# EAGLE design esp8266_3C_noGND (EAGLE 7.5.0)
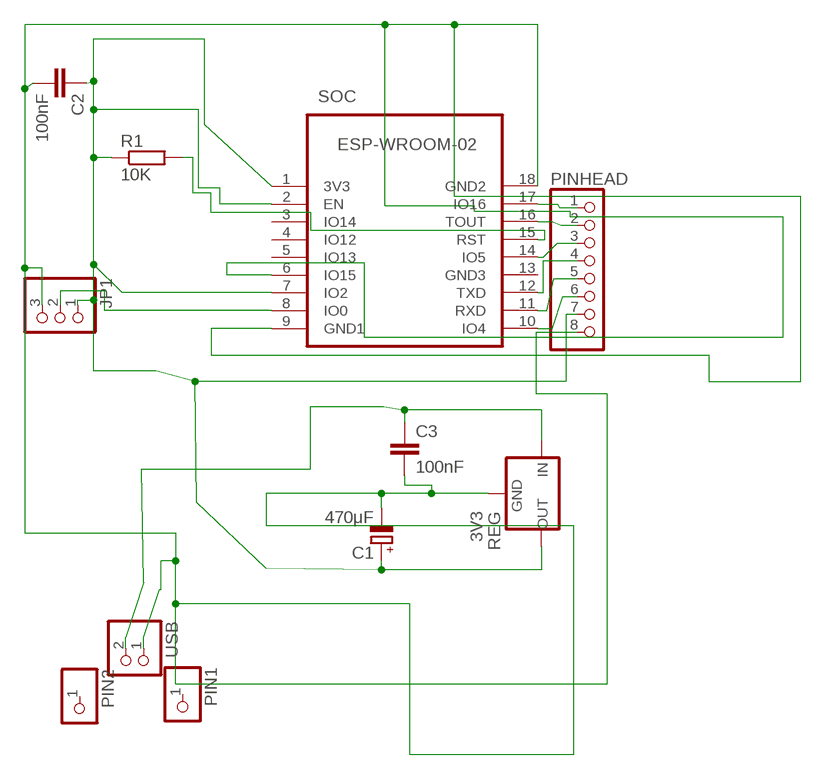
[diagram p0: schematic, sheet 1]

## Parts
C1  470μF  CPOL-EUE2.5-7  [E2,5-7]
C2  100nF  C-EUC0603  [C0603]
C3  100nF  C-EUC0603  [C0603]
JP1  PINHD-1X3  [1X03]
PIN1  PINHD-1X1  [1X01]
PIN2  PINHD-1X1  [1X01]
PINHEAD  PINHD-1X8  [1X08]
R1  10K  R-EU_R0603  [R0603]
REG  3V3  78XXS  [78XXS]
SOC  ESP-WROOM-02  ESP-WROOM-02-CP2FRONT  [FRONT-FACE-CP2]
USB  PINHD-1X2  [1X02]

## Nets
N$1: JP1.2 SOC.8(IO0)
N$2: C3.1 REG.IN USB.2
N$6: PINHEAD.1 SOC.17(IO16)
N$7: PINHEAD.2 SOC.16(TOUT)
N$8: PINHEAD.3 SOC.14(IO5)
N$9: PINHEAD.4 SOC.12(TXD)
N$10: PINHEAD.5 SOC.11(RXD)
N$11: PINHEAD.6 SOC.10(IO4)
N$12: C1.+ C2.1 JP1.1 PINHEAD.7 R1.1 REG.OUT SOC.1(3V3) SOC.2(EN) SOC.7(IO2)
N$13: R1.2 SOC.15(RST)
USB: C1.- C2.2 C3.2 JP1.3 PINHEAD.8 REG.GND SOC.6(IO15) SOC.9(GND1) SOC.18(GND2) USB.1
Unconnected: PIN1.1 PIN2.1 SOC.3(IO14) SOC.4(IO12) SOC.5(IO13) SOC.13(GND3)

## Library data of the parts
C1 = rcl:CPOL-EU: POLARIZED CAPACITOR, European symbol
C2 C3 = resistor:C-EU: CAPACITOR, European symbol
JP1 = pinhead:PINHD-1X3: PIN HEADER
PIN1 PIN2 = pinhead-ext3:PINHD-1X1: PIN HEADER
PINHEAD = pinhead:PINHD-1X8: PIN HEADER
R1 = resistor:R-EU_: RESISTOR, European symbol
REG = v-reg:78XXS: VOLTAGE REGULATOR
SOC = esp-wroom-02-CP2:ESP-WROOM-02-CP2: WiFi module - ESP-WROOM-02
USB = pinhead:PINHD-1X2: PIN HEADER

## Board
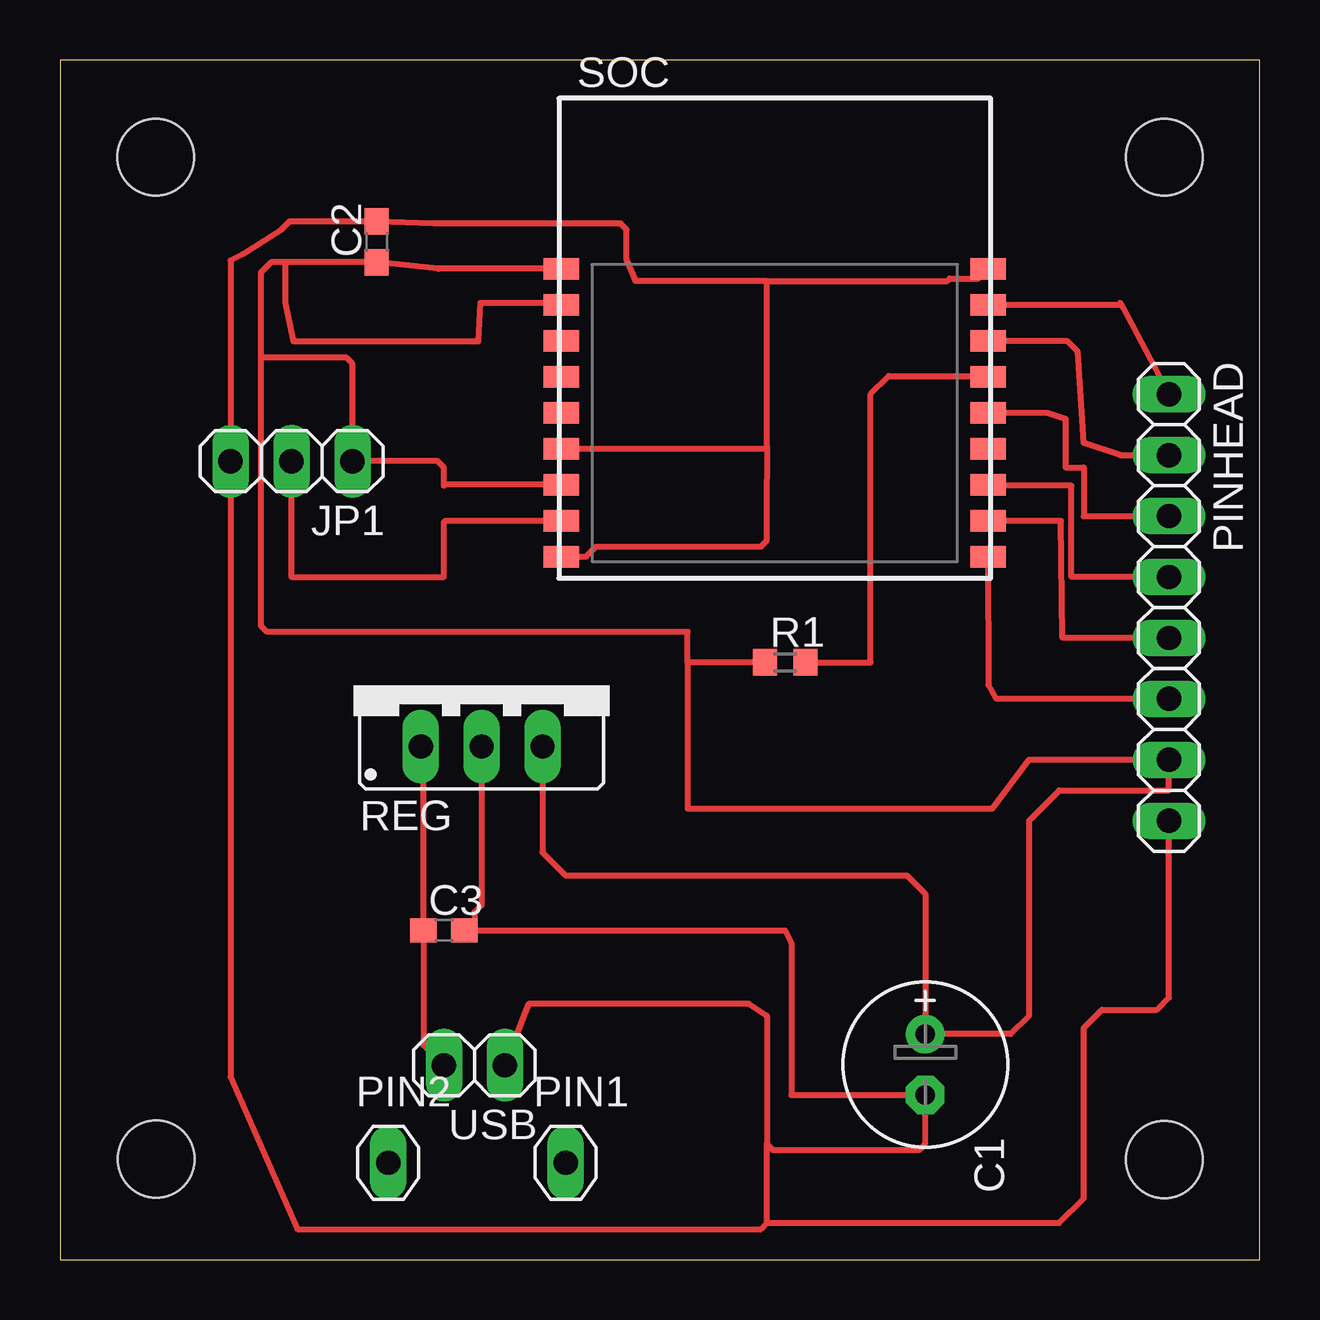
[diagram p1: board, top side]

Size 50 x 50 mm. Coordinates in mm from the lower left corner, seen from the top.
Outline: 0,0 50,0 50,50 0,50 0,0
Copper layers (1*16): Top 0.035mm / dielectric 1.6mm / Bottom 0.035mm
Design rules "Elecrow_2-layer_PCB_eagle_rule": minimum track width 6mil, minimum drill 12mil, track to track 6mil, track to pad 6mil, pad to pad 6mil, via to via 8mil, smd to smd 0mil, copper to edge 20mil, drill to drill 10mil, minimum pad ring 6mil, minimum via ring 6mil, stop-mask expansion 0mil, vias tented up to drill 100mil, thermal gap 10mil
Holes 3.2 mm at 4.01,4.19 3.99,45.95 46.03,45.95 46.03,4.17

### Footprints (pad centres in the part's own frame; a part is rotated, then mirrored left to right if it is on the bottom)
E2,5-7 = drill 0.813 pad 1.6: + -1.27,0 | drill 0.813 pad 1.6 octagon: - 1.27,0
C0603 = smd 1.1 x 1: 1 -0.85,0; 2 0.85,0
1X03 = drill 1.016 long: 1 -2.54,0; 2 0,0; 3 2.54,0
1X01 = drill 1.016 long: 1 0,0
1X08 = drill 1.016 long: 1 -8.89,0; 2 -6.35,0; 3 -3.81,0; 4 -1.27,0; 5 1.27,0; 6 3.81,0; 7 6.35,0; 8 8.89,0
R0603 = smd 1 x 1.1: 1 -0.85,0; 2 0.85,0
78XXS = drill 1.016 long: GND 0,-2.54; IN -2.54,-2.54; OUT 2.54,-2.54
FRONT-FACE-CP2 = smd 1.485 x 0.9: 1 -8.893,4.9; 2 -8.893,3.4; 3 -8.893,1.9; 4 -8.893,0.4; 5 -8.893,-1.1; 6 -8.893,-2.6; 7 -8.893,-4.1; 8 -8.893,-5.6; 9 -8.893,-7.1; 10 8.893,-7.1; 11 8.893,-5.6; 12 8.893,-4.1; 13 8.893,-2.6; 14 8.893,-1.1; 15 8.893,0.4; 16 8.893,1.9; 17 8.893,3.4; 18 8.893,4.9
1X02 = drill 1.016 long: 1 -1.27,0; 2 1.27,0

### Placement (x,y rotation side)
C1  36.07,8.13 270 top
C2  13.21,42.42 90 top
C3  16,13.72 0 top
JP1  9.65,33.27 180 top
PIN1  21.08,4.03 0 top
PIN2  13.68,4.03 0 top
PINHEAD  46.23,27.18 270 top
R1  30.23,24.89 0 top
REG  17.57,23.92 0 top
SOC  29.79,36.4 0 top
USB  17.27,8.1 180 top

### Tracks (layer width: path | path; a pad name or v marks a point on that pad's centre or on a via)
N$1
  Top 0.254: JP1.2 9.65,28.45 16,28.45 16,30.73 16.07,30.8 SOC.8
N$2
  Top 0.254: USB.2 15.15,8.95 C3.1 15.15,21.27 REG.IN
N$6
  Top 0.254: 44.2,39.88 44.29,39.69 | 44.29,39.69 PINHEAD.1 | SOC.17 44.19,39.8 44.29,39.69
N$7
  Top 0.254: PINHEAD.2 44.2,33.53 42.67,34.04 42.42,37.85 41.97,38.3 SOC.16
N$8
  Top 0.254: SOC.14 41.16,35.3 41.91,35.05 41.91,33.02 42.67,33.02 42.67,30.99 PINHEAD.3
N$9
  Top 0.254: SOC.12 38.73,32.26 42.16,32.26 42.16,28.45 PINHEAD.4
N$10
  Top 0.254: SOC.11 41.72,30.8 41.78,25.91 PINHEAD.5
N$11
  Top 0.254: SOC.10 38.7,23.96 39.04,23.37 PINHEAD.6
N$12
  Top 0.254: 26.16,24.89 26.16,26.16 8.64,26.16 8.38,26.42 8.38,37.59 | 8.38,37.59 8.38,41.15 8.8,41.57 9.4,41.57 | 8.38,37.59 11.94,37.59 12.19,37.34 JP1.1 15.75,33.27 16,33.02 16,32.26 16.04,32.3 SOC.7 | 26.16,24.89 26.16,18.8 38.86,18.8 40.39,20.83 PINHEAD.7 46.23,19.56 41.66,19.56 40.39,18.29 40.39,10.16 39.62,9.4 C1.+ 36.07,15.24 35.31,16 21.08,16 20.11,16.97 REG.OUT | R1.1 26.16,24.89 | 9.4,41.57 C2.1 15.76,41.3 SOC.1 | 9.4,41.57 9.4,39.88 9.73,38.27 17.45,38.27 17.53,39.88 20.82,39.88 SOC.2
N$13
  Top 0.254: SOC.15 38.65,36.83 34.54,36.83 33.78,36.07 33.78,24.89 R1.2
USB
  Top 0.254: PINHEAD.8 46.23,10.92 45.72,10.41 43.43,10.41 42.67,9.65 42.67,2.54 41.66,1.52 29.46,1.52 | USB.1 19.56,10.67 28.7,10.67 29.46,10.16 29.46,4.83 | 29.46,4.83 29.72,4.57 35.81,4.57 36.07,4.83 C1.- 30.48,6.86 30.48,13.21 30.23,13.72 C3.2 17.27,14.14 17.27,14.48 17.57,14.78 REG.GND | 29.46,1.52 29.46,4.83 | 29.46,1.52 29.21,1.27 9.91,1.27 7.11,7.62 JP1.3 7.11,41.66 7.62,41.91 9.21,42.93 9.55,43.27 C2.2 15.58,43.18 23.37,43.18 23.62,42.93 23.62,41.66 23.98,40.79 29.46,40.79 | SOC.6 29.48,33.8 | 29.48,33.8 29.46,34.04 29.46,40.79 | 29.48,33.8 29.46,31.27 29.46,29.97 29.21,29.72 22.35,29.72 21.93,29.3 SOC.9 | 29.46,40.79 36.98,40.79 37.08,40.89 38.28,40.89 SOC.18